# EAGLE design raspi (EAGLE 6.6.0)
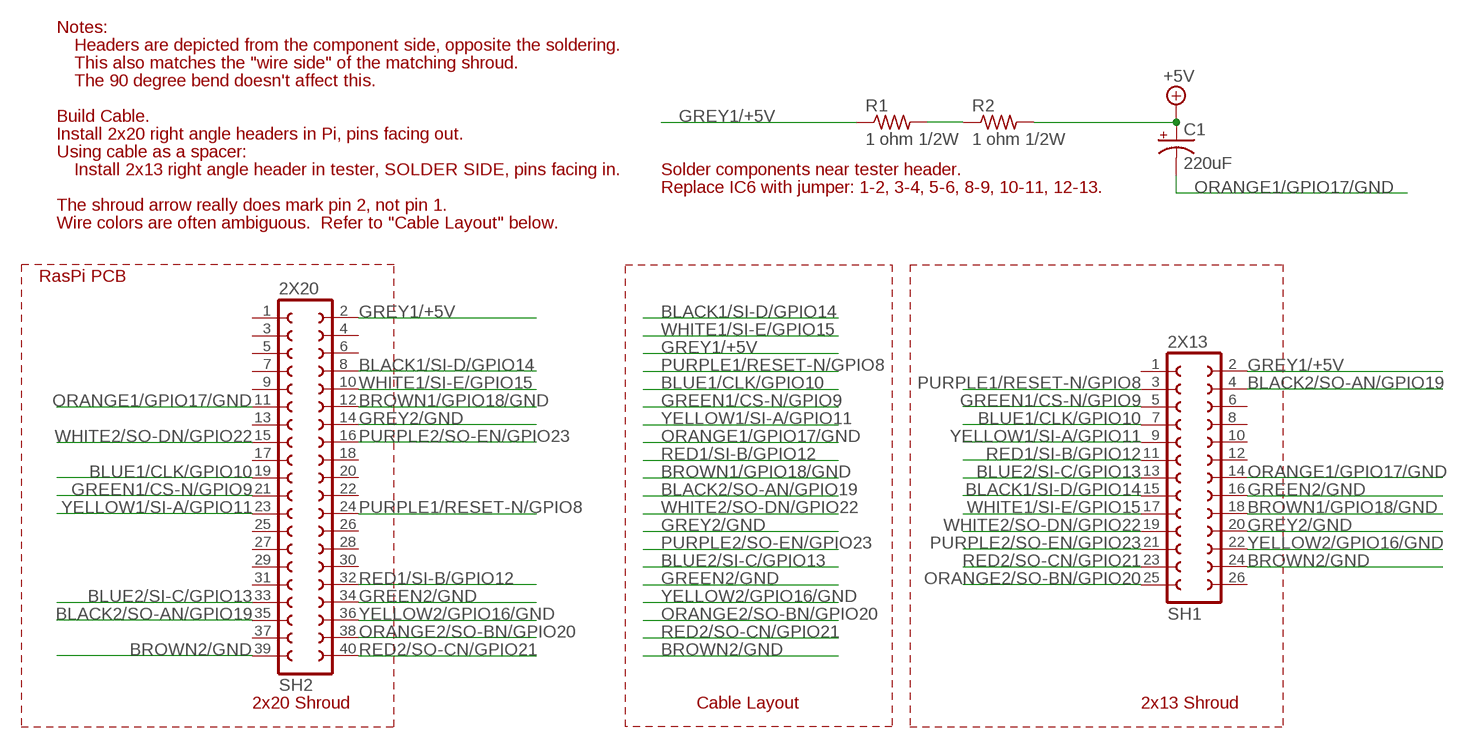
[diagram p0: schematic, sheet 1]

## Parts
C1  220uF  CPOL-USE15-6AXIAL  [E15-6]
R1  1 ohm 1/2W  R-US_0207/10  [0207/10]
R2  1 ohm 1/2W  R-US_0207/10  [0207/10]
SH1  2X13  FE13-2  [FE13-2]
SH2  2X20  FE20-2  [FE20-2]

## Nets
+5V: C1.+ R2.2
BLACK1/SI-D/GPIO14: SH1.15 SH2.8
BLACK2/SO-AN/GPIO19: SH1.4 SH2.35
BLUE1/CLK/GPIO10: SH1.7 SH2.19
BLUE2/SI-C/GPIO13: SH1.13 SH2.33
BROWN1/GPIO18/GND [Supply]: SH1.18 SH2.12
BROWN2/GND [Supply]: SH1.24 SH2.39
GREEN1/CS-N/GPIO9: SH1.5 SH2.21
GREEN2/GND: SH1.16 SH2.34
GREY1/+5V: R1.1 SH1.2 SH2.2
GREY2/GND [Supply]: SH1.20 SH2.14
N$1: R1.2 R2.1
ORANGE1/GPIO17/GND [Supply]: C1.- SH1.14 SH2.11
ORANGE2/SO-BN/GPIO20: SH1.25 SH2.38
PURPLE1/RESET-N/GPIO8: SH1.3 SH2.24
PURPLE2/SO-EN/GPIO23: SH1.21 SH2.16
RED1/SI-B/GPIO12: SH1.11 SH2.32
RED2/SO-CN/GPIO21: SH1.23 SH2.40
WHITE1/SI-E/GPIO15: SH1.17 SH2.10
WHITE2/SO-DN/GPIO22: SH1.19 SH2.15
YELLOW1/SI-A/GPIO11: SH1.9 SH2.23
YELLOW2/GPIO16/GND: SH1.22 SH2.36
Unconnected: SH1.1 SH1.6 SH1.8 SH1.10 SH1.12 SH1.26 SH2.1 SH2.3 SH2.4 SH2.5 SH2.6 SH2.7 SH2.9 SH2.13 SH2.17 SH2.18 SH2.20 SH2.22 SH2.25 SH2.26 SH2.27 SH2.28 SH2.29 SH2.30 SH2.31 SH2.37

## Notes on the sheet
- Notes:
- Headers are depicted from the component side, opposite the soldering.
- This also matches the "wire side" of the matching shroud.
- The 90 degree bend doesn't affect this.
- Build Cable.
- Install 2x20 right angle headers in Pi, pins facing out.
- Using cable as a spacer:
- Install 2x13 right angle header in tester, SOLDER SIDE, pins facing in. | Solder components near tester header.
- Replace IC6 with jumper: 1-2, 3-4, 5-6, 8-9, 10-11, 12-13.
- The shroud arrow really does mark pin 2, not pin 1.
- Wire colors are often ambiguous.  Refer to "Cable Layout" below.
- RasPi PCB
- 2x20 Shroud | Cable Layout | 2x13 Shroud

## Library data of the parts
C1 = rcl:CPOL-US: POLARIZED CAPACITOR, American symbol
R1 R2 = rcl:R-US_: RESISTOR, American symbol
SH1 = con-lsta:FE13-2: FEMALE HEADER; OC_FARNELL: unknown; OC_NEWARK: unknown
SH2 = con-lsta:FE20-2: FEMALE HEADER; OC_FARNELL: unknown; OC_NEWARK: unknown

## Board
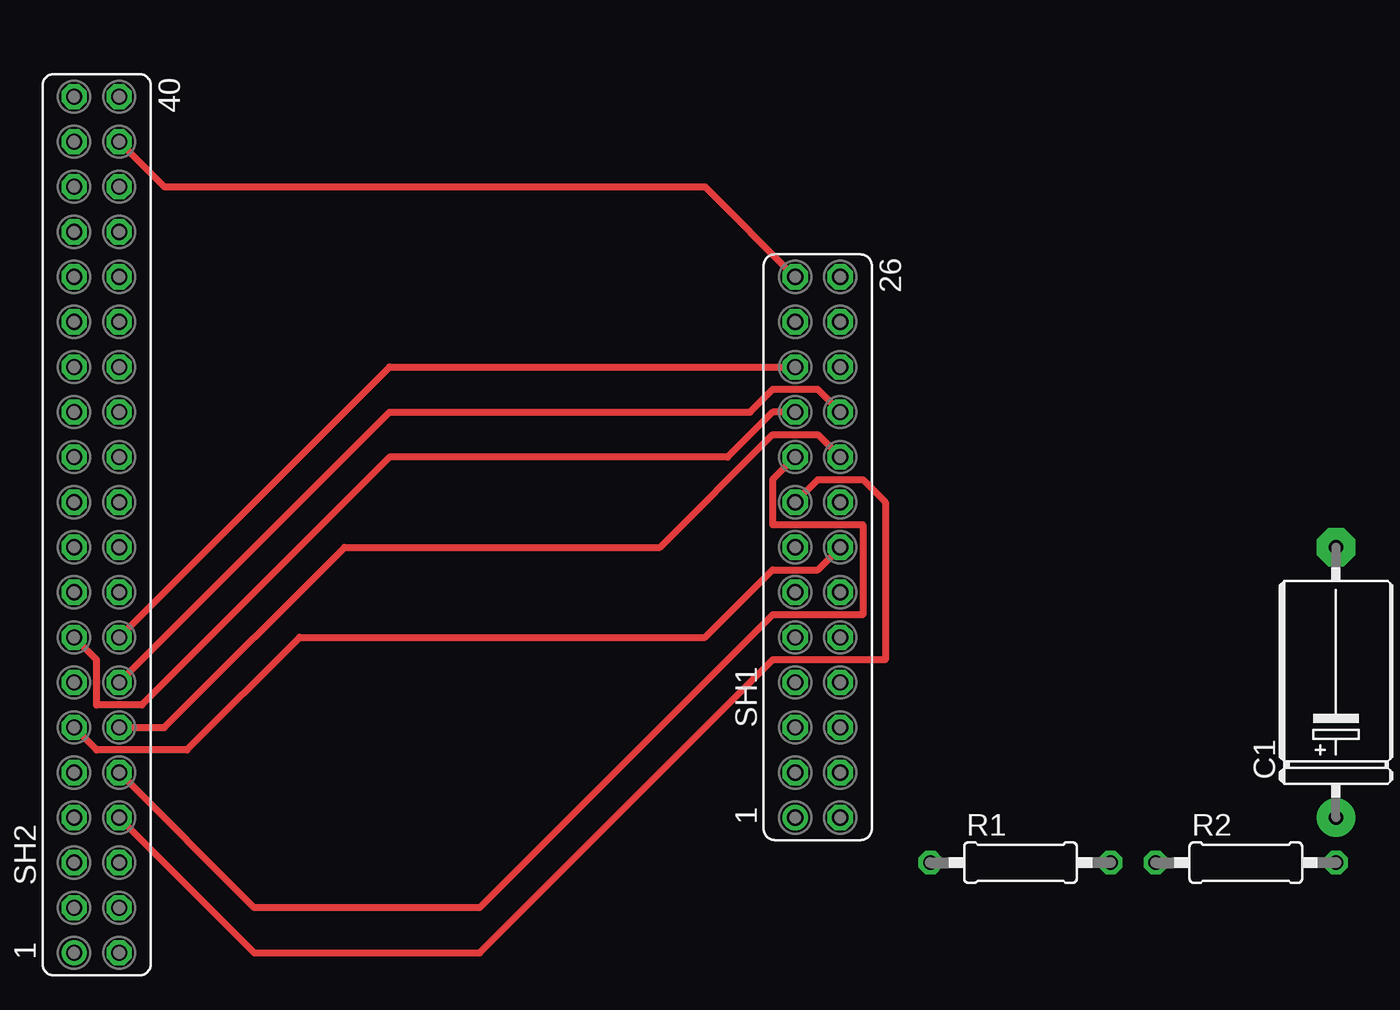
[diagram p1: board, top side]
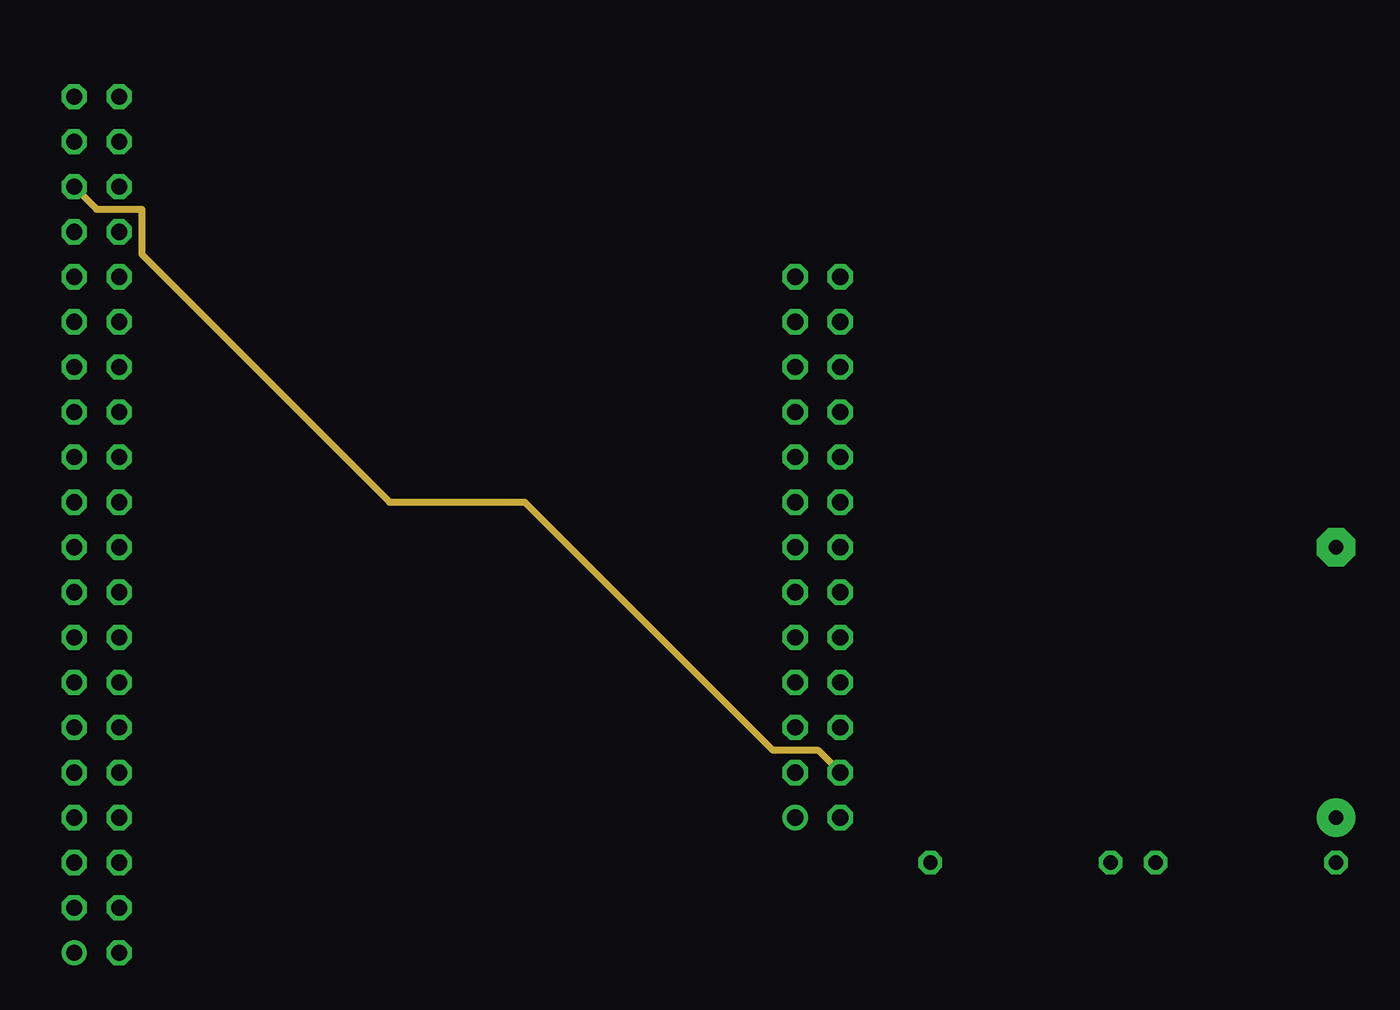
[diagram p2: board, inner layer Route2]
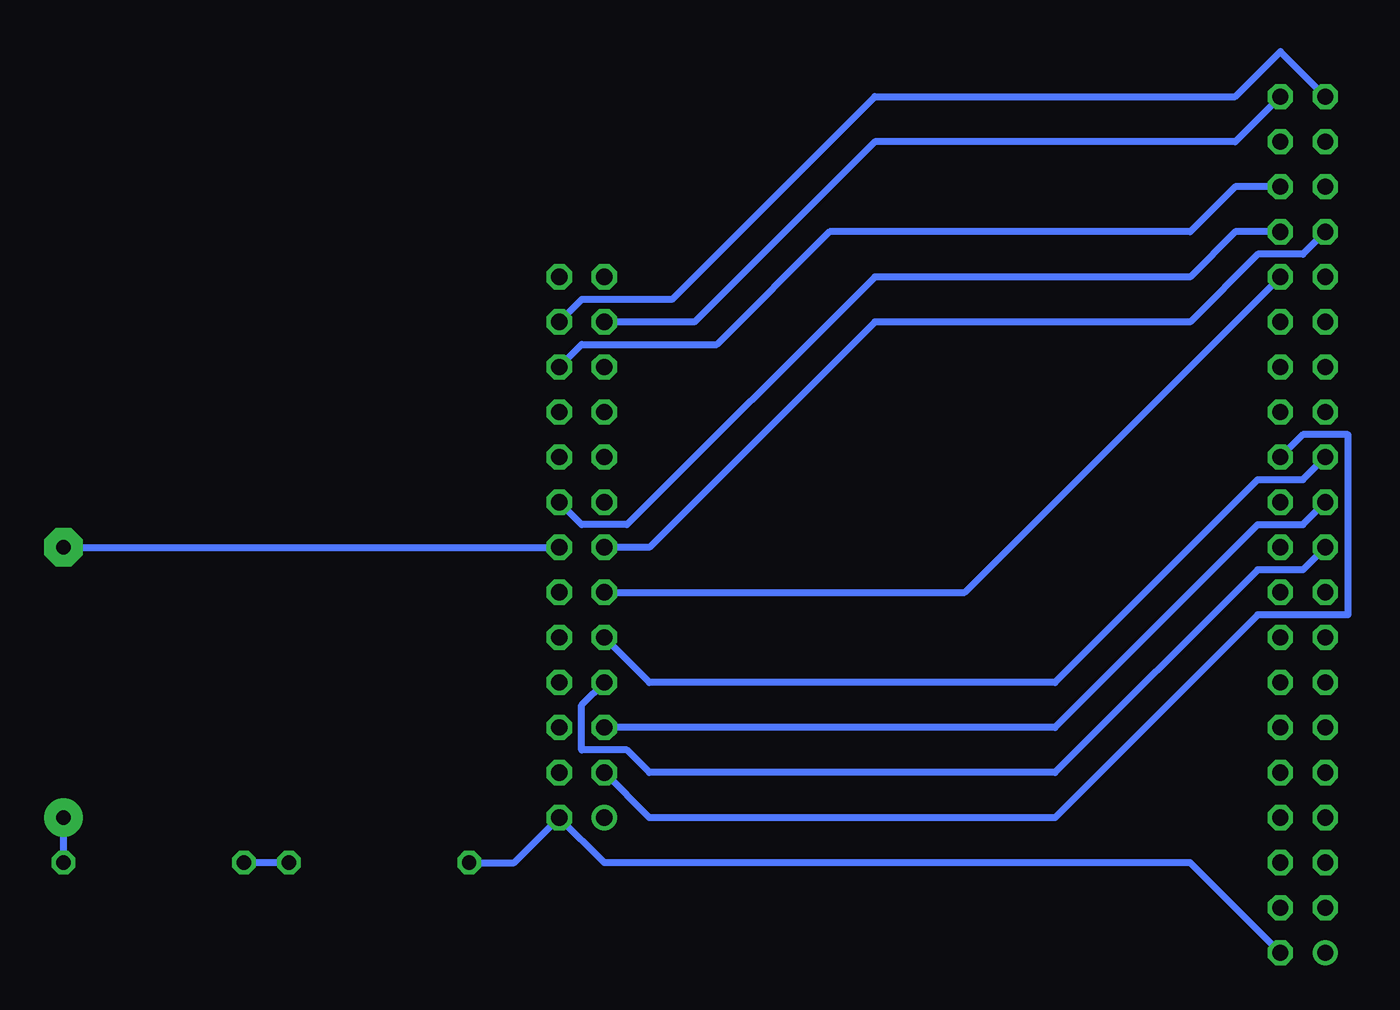
[diagram p3: board, bottom side, seen from below]

No outline drawn. Coordinates in mm, seen from the top.
Copper layers (1+2+16): Top 0.035mm / dielectric 1.5mm / Route2 0.035mm / dielectric 0.15mm / Bottom 0.035mm
Design rules "16mils *": minimum track width 16mil, minimum drill 32mil, track to track 15mil, track to pad 10mil, pad to pad 10mil, via to via 10mil, smd to smd 10mil, copper to edge 13mil, drill to drill 10mil, minimum pad ring 10mil, minimum via ring 8mil, stop-mask expansion 0mil, vias tented up to drill 0mil, thermal gap 10mil

### Footprints (pad centres in the part's own frame; a part is rotated, then mirrored left to right if it is on the bottom)
E15-6 = drill 0.813 pad 2.159: + -7.62,0 | drill 0.813 pad 2.159 octagon: - 7.62,0
0207/10 = drill 0.813 octagon: 1 -5.08,0; 2 5.08,0
FE13-2 = drill 0.914: 1 -15.24,1.27 | drill 0.914 octagon: 2 -15.24,-1.27; 3 -12.7,1.27; 4 -12.7,-1.27; 5 -10.16,1.27; 6 -10.16,-1.27; 7 -7.62,1.27; 8 -7.62,-1.27; 9 -5.08,1.27; 10 -5.08,-1.27; 11 -2.54,1.27; 12 -2.54,-1.27; 13 0,1.27; 14 0,-1.27; 15 2.54,1.27; 16 2.54,-1.27; 17 5.08,1.27; 18 5.08,-1.27; 19 7.62,1.27; 20 7.62,-1.27; 21 10.16,1.27; 22 10.16,-1.27; 23 12.7,1.27; 24 12.7,-1.27; 25 15.24,1.27; 26 15.24,-1.27
FE20-2 = drill 0.914: 1 -24.13,1.27 | drill 0.914 octagon: 2 -24.13,-1.27; 3 -21.59,1.27; 4 -21.59,-1.27; 5 -19.05,1.27; 6 -19.05,-1.27; 7 -16.51,1.27; 8 -16.51,-1.27; 9 -13.97,1.27; 10 -13.97,-1.27; 11 -11.43,1.27; 12 -11.43,-1.27; 13 -8.89,1.27; 14 -8.89,-1.27; 15 -6.35,1.27; 16 -6.35,-1.27; 17 -3.81,1.27; 18 -3.81,-1.27; 19 -1.27,1.27; 20 -1.27,-1.27; 21 1.27,1.27; 22 1.27,-1.27; 23 3.81,1.27; 24 3.81,-1.27; 25 6.35,1.27; 26 6.35,-1.27; 27 8.89,1.27; 28 8.89,-1.27; 29 11.43,1.27; 30 11.43,-1.27; 31 13.97,1.27; 32 13.97,-1.27; 33 16.51,1.27; 34 16.51,-1.27; 35 19.05,1.27; 36 19.05,-1.27; 37 21.59,1.27; 38 21.59,-1.27; 39 24.13,1.27; 40 24.13,-1.27

### Placement (x,y rotation side)
C1  76.2,22.86 90 top
R1  58.42,12.7 0 top
R2  71.12,12.7 0 top
SH1  46.99,30.48 90 top
SH2  6.35,31.75 90 top

### Tracks (layer width: path | path; a pad name or v marks a point on that pad's centre or on a via)
+5V
  Bottom 0.406: R2.2 C1.+
BLACK1/SI-D/GPIO14
  Top 0.406: SH2.8 15.24,7.62 27.94,7.62 44.45,24.13 50.8,24.13 50.8,33.02 49.53,34.29 46.99,34.29 SH1.15
BLACK2/SO-AN/GPIO19
  Route2 0.406: SH2.35 6.35,49.53 8.89,49.53 8.89,46.99 22.86,33.02 30.48,33.02 44.45,19.05 46.99,19.05 SH1.4
BLUE1/CLK/GPIO10
  Bottom 0.406: SH2.19 6.35,29.21 8.89,29.21 20.32,17.78 43.18,17.78 44.45,19.05 46.99,19.05 46.99,21.59 SH1.7
BLUE2/SI-C/GPIO13
  Bottom 0.406: SH1.13 43.18,30.48 30.48,43.18 12.7,43.18 8.89,46.99 6.35,46.99 SH2.33
BROWN1/GPIO18/GND
  Top 0.406: SH2.12 10.16,20.32 20.32,30.48 38.1,30.48 44.45,36.83 46.99,36.83 SH1.18
BROWN2/GND
  Bottom 0.406: SH2.39 7.62,58.42 10.16,55.88 30.48,55.88 41.91,44.45 46.99,44.45 SH1.24
GREEN1/CS-N/GPIO9
  Bottom 0.406: SH1.5 20.32,20.32 8.89,31.75 6.35,31.75 SH2.21
GREEN2/GND
  Bottom 0.406: SH2.34 10.16,48.26 12.7,45.72 30.48,45.72 44.45,31.75 46.99,31.75 SH1.16
GREY1/+5V
  Bottom 0.406: SH2.2 12.7,12.7 45.72,12.7 SH1.2 50.8,12.7 R1.1
GREY2/GND
  Top 0.406: SH2.14 22.86,38.1 43.18,38.1 44.45,39.37 46.99,39.37 SH1.20
N$1
  Bottom 0.406: R1.2 R2.1
ORANGE1/GPIO17/GND
  Top 0.406: SH2.11 6.35,19.05 11.43,19.05 17.78,25.4 40.64,25.4 44.45,29.21 46.99,29.21 SH1.14
  Bottom 0.406: C1.- SH1.14
ORANGE2/SO-BN/GPIO20
  Top 0.406: SH2.38 10.16,50.8 40.64,50.8 SH1.25
PURPLE1/RESET-N/GPIO8
  Bottom 0.406: SH1.3 43.18,15.24 20.32,15.24 8.89,26.67 3.81,26.67 3.81,36.83 6.35,36.83 SH2.24
PURPLE2/SO-EN/GPIO23
  Top 0.406: SH2.16 22.86,40.64 SH1.21
RED1/SI-B/GPIO12
  Bottom 0.406: SH2.32 25.4,27.94 SH1.11
RED2/SO-CN/GPIO21
  Bottom 0.406: SH2.40 10.16,53.34 30.48,53.34 40.64,43.18 SH1.23
WHITE1/SI-E/GPIO15
  Top 0.406: SH2.10 15.24,10.16 27.94,10.16 44.45,26.67 49.53,26.67 49.53,31.75 44.45,31.75 44.45,34.29 SH1.17
WHITE2/SO-DN/GPIO22
  Top 0.406: SH1.19 44.45,38.1 41.91,35.56 22.86,35.56 8.89,21.59 6.35,21.59 6.35,24.13 SH2.15
YELLOW1/SI-A/GPIO11
  Bottom 0.406: SH1.9 43.18,22.86 20.32,22.86 8.89,34.29 6.35,34.29 SH2.23
YELLOW2/GPIO16/GND
  Bottom 0.406: SH2.36 10.16,50.8 12.7,48.26 33.02,48.26 39.37,41.91 46.99,41.91 SH1.22